# Altium schematic sheet xy-supply.SchDoc
size A
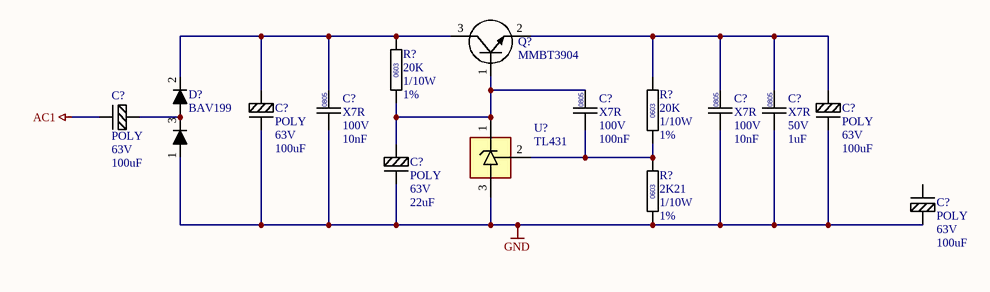
[diagram p0: xy-supply.SchDoc]

## Parts
(Parts that share a designator on the sheet are numbered #1, #2 ... from top to bottom, then left to right.)
C?#1  Dielectric: POLY  Voltage: 63V  Capacitance: 100uF  [CAPC0603]  (hidden comment: CAPP)
C?#2  Dielectric: X7R  Voltage: 100V  Capacitance: 10nF  [CAPC0805]  (hidden comment: CAP0805)
C?#3  Dielectric: X7R  Voltage: 100V  Capacitance: 100nF  [CAPC0805]  (hidden comment: CAP0805)
C?#4  Dielectric: X7R  Voltage: 100V  Capacitance: 10nF  [CAPC0805]  (hidden comment: CAP0805)
C?#5  Dielectric: X7R  Voltage: 50V  Capacitance: 1uF  [CAPC0805]  (hidden comment: CAP0805)
C?#6  Dielectric: POLY  Voltage: 63V  Capacitance: 100uF  [CAPC0603]  (hidden comment: CAPP)
C?#7  Dielectric: POLY  Voltage: 63V  Capacitance: 100uF  [CAPC0603]  (hidden comment: CAPP)
C?#8  Dielectric: POLY  Voltage: 63V  Capacitance: 22uF  [CAPC0603]  (hidden comment: CAPP)
C?#9  Dielectric: POLY  Voltage: 63V  Capacitance: 100uF  [CAPC0603]  (hidden comment: CAPP)
D?  BAV199  [SOD323]
Q?  MMBT3904  [SOT23]
R?#1  value 20K  Power: 1/10W  Tolerance: 1%  [RESC0603]  (hidden comment: RESC0603)
R?#2  value 20K  Power: 1/10W  Tolerance: 1%  [RESC0603]  (hidden comment: RESC0603)
R?#3  value 2K21  Power: 1/10W  Tolerance: 1%  [RESC0603]  (hidden comment: RESC0603)
U?  TL431  [SOT23]

## Nets
AC1: C?#7.2
GND: C?#1.2 C?#2.2 C?#4.2 C?#5.2 C?#6.2 C?#8.2 C?#9.1 D?.1(K) R?#3.2 U?.3
NetC?#1_1: C?#1.1 C?#2.1 D?.2(A) Q?.3(C) R?#1.1
NetC?#3_1: C?#3.1 C?#8.1 Q?.1(B) R?#1.2 U?.1
NetC?#3_2: C?#3.2 R?#2.2 R?#3.1 U?.2
NetC?#4_1: C?#4.1 C?#5.1 C?#6.1 Q?.2(E) R?#2.1
NetC?#7_1: C?#7.1 D?.3(A)

Not connected (* = marked no-connect by the designer): C?#9 2

## Notes on the sheet
- (in symbol CAPC-0805-1uF-50V) 0805
- (in symbol CAPC-0805-10nF-100V) 0805
- (in symbol CAPC-0805-100nF-100V) 0805
- (in symbol RESC-0603-2K21-1%-1/10W) 0603
- (in symbol RESC-0603-20K-1%-1/10W) 0603

## Library data of the parts
C?#1 C?#6 C?#7 C?#9 = CAPP-0603-100uF-63V-POLY: CAPACITOR,POLYMER,100uF,63V,100X102; Manufacturer 1: PANASONIC; Manufacturer Part Number 1: EEHZC1H101P; Package / Case: CAPP100D102H; Location: *; LCSC: C161937
C?#2 C?#4 = CAPC-0805-10nF-100V: CAPACITOR,CERAMIC,10nF,100V,X7R,0805; Package / Case: 0805 (2012 metric); Location: *
C?#3 = CAPC-0805-100nF-100V: CAPACITOR,CERAMIC,100nF,100V,X7R,0805; Package / Case: 0805 (2012 metric); Location: *
C?#5 = CAPC-0805-1uF-50V: CAPACITOR,CERAMIC,1uF,50V,X7R,0805; Package / Case: 0805 (2012 metric); Location: *
C?#8 = CAPP-0603-22uF-63V-POLY: CAPACITOR,POLYMER,22uF,63V,100X102; Manufacturer 1: PANASONIC; Manufacturer Part Number 1: EEHZC1H101P; Package / Case: CAPP100D102H; Location: *; LCSC: C161937
D? = DIODE-DIODES-BAV199: DIODE,75V,215mA,SOT23,LOW LEAKAGE; Supplier 1: Arrow Electronics; Supplier Part Number 1: BAV116WS-7
Q? = XSTR-NPN-MMBT3904: XSTR,NPN,SOT23,MMBT3904
R?#1 R?#2 = RESC-0603-20K-1%-1/10W: RESISTOR,20K,1%,100mW,0603 (1608); Location: *; LCSC: C105588; Supplier 1: Digikey; Supplier Part Number 1: 311-100HRCT-ND
R?#3 = RESC-0603-2K21-1%-1/10W: RESISTOR,2K21,1%,100mW,0603 (1608); Location: *; LCSC: C105588; Supplier 1: Digikey; Supplier Part Number 1: 311-100HRCT-ND
U? = IC-TI-TL431: IC,VOLTAGE REFERENCE,3.0V; Supplier 1: Mouser; Supplier Part Number 1: 926-LM4040AIM330NOPB; LCSC: C460608